# EAGLE schematic pc_healthypi_v1 (EAGLE 6.4)

## Sheet 1 of 3
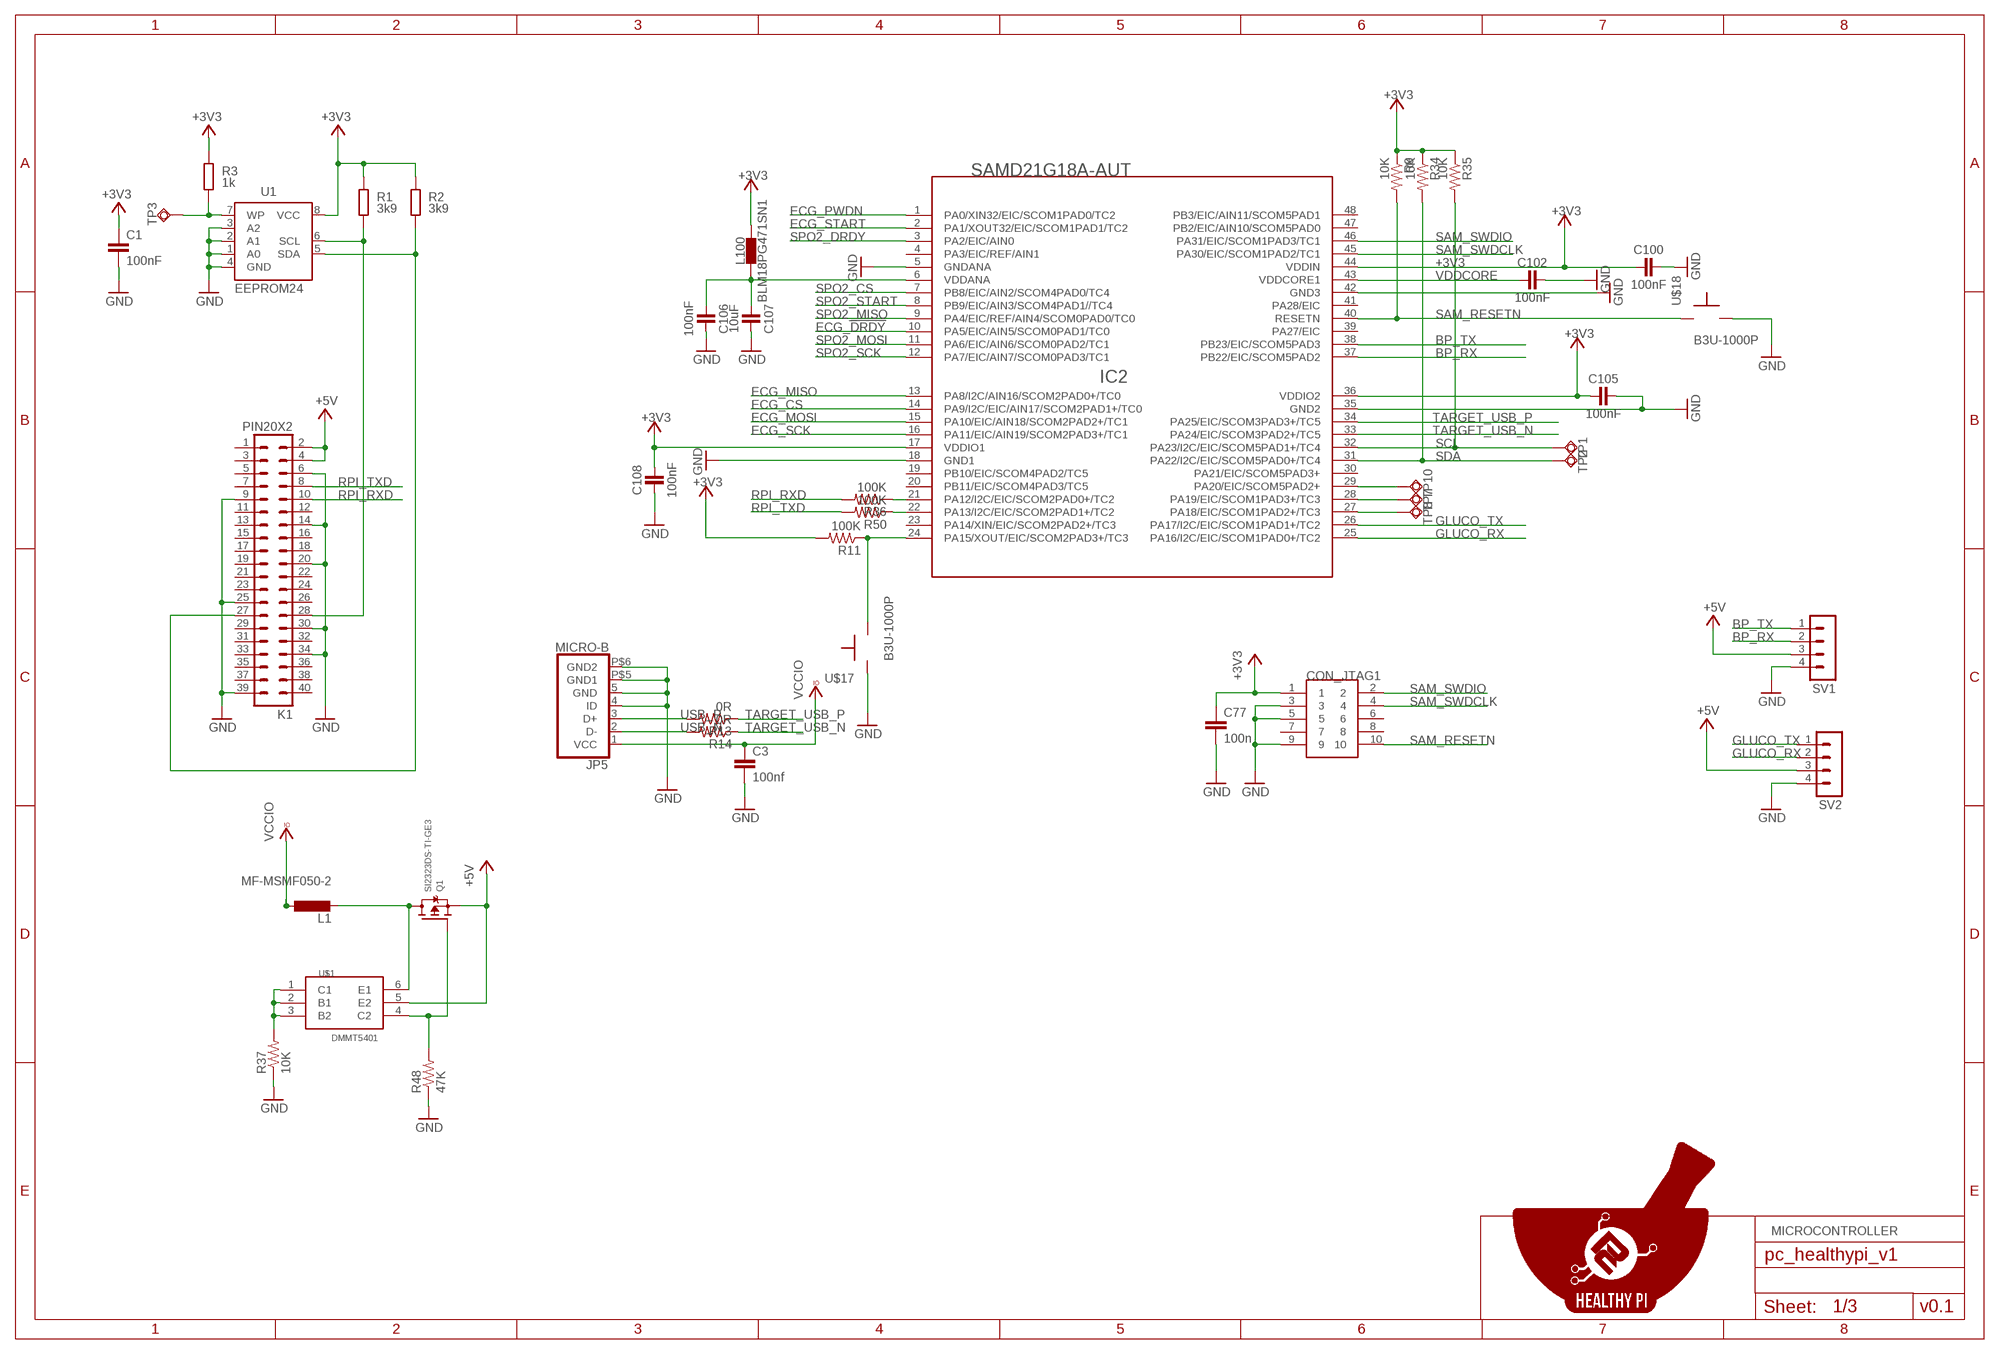
[diagram p0: schematic, sheet 1]

### Parts
C1  100nF  C-EUC0805K  [C0805K]
C3  100nf  C-EUC0402  [C0402]
C77  100n  C-EUC0805  [C0805]
C100  100nF  CAPACITORS-0805  [C0805]
C102  100nF  CAPACITORS-0805  [C0805]
C105  100nF  CAPACITORS-0805  [C0805]
C106  100nF  CAPACITORS-0805  [C0805]
C107  10uF  CAPACITORS-0805  [C0805]
C108  100nF  CAPACITORS-0805  [C0805]
CON_JTAG1  HDR-SMT-50MIL/5X2  [HDR-SMT-50MIL/5X2]
IC2  SAMD21G18A-AUT  SAMD21G18A  [TQFP48]
JP5  MICRO-B  [MICRO-B]
K1  PIN20X2  [PIN_20X2]
L1  MF-MSMF050-2  L-EUL1812  [L1812]
L100  BLM18PG471SN1  INDUCTOR-0603  [C0603]
Q1  SI2323DS-TI-GE3  MOSFET-P  [SOT23-R]
R1  3k9  R-EU_M0805  [M0805]
R2  3k9  R-EU_M0805  [M0805]
R3  1k  R-EU_M0805  [M0805]
R9  10K  R-US_R0805  [R0805]
R11  100K  R-US_R0805  [R0805]
R13  0R  R-US_R0402  [R0402]
R14  0R  R-US_R0402  [R0402]
R34  10K  R-US_R0805  [R0805]
R35  10K  R-US_R0805  [R0805]
R36  100K  R-US_R0402  [R0402]
R37  10K  R-US_R0805  [R0805]
R48  47K  R-US_R0805  [R0805]
R50  100K  R-US_R0402  [R0402]
SV1  MA04-1  [MA04-1]
SV2  MA04-1  [MA04-1]
TP1  TPSQB1,27  [B1,27]
TP2  TPSQB1,27  [B1,27]
TP3  TPSQB1,27  [B1,27]
TP7  TPSQB1,27  [B1,27]
TP8  TPSQB1,27  [B1,27]
TP10  TPSQB1,27  [B1,27]
U1  EEPROM24  [SOIC8]
U$1  DMMT5401  [SOT26]
U$15  HEALTHYPI  [HEALTHYPI]
U$17  B3U-1000P  [B3U-1000P]
U$18  B3U-1000P  [B3U-1000P]

### Nets
+3V3: C1.1 C77.1 C100.1 C105.1 C108.2 CON_JTAG1.1 IC2.17(VDDIO1) IC2.36(VDDIO2) IC2.44(VDDIN) L100.2 R1.2 R2.2 R3.2 R9.1 R11.2 R34.1 R35.1 U1.8(VCC) ; also sheet 2,3
+5V: K1.2 K1.4 Q1.2(S) SV1.3 SV2.3 U$1.5(E2) ; also sheet 2,3
BP_RX: IC2.37(PB22/EIC/SCOM5PAD2) SV1.2
BP_TX: IC2.38(PB23/EIC/SCOM5PAD3) SV1.1
ECG_!DRDY: IC2.10(PA5/EIC/AIN5/SCOM0PAD1/TC0) ; also sheet 2
ECG_CS: IC2.14(PA9/I2C/EIC/AIN17/SCOM2PAD1+/TC0) ; also sheet 2
ECG_MISO: IC2.13(PA8/I2C/AIN16/SCOM2PAD0+/TC0) ; also sheet 2
ECG_MOSI: IC2.15(PA10/EIC/AIN18/SCOM2PAD2+/TC1) ; also sheet 2
ECG_PWDN: IC2.1(PA0/XIN32/EIC/SCOM1PAD0/TC2) ; also sheet 2
ECG_SCK: IC2.16(PA11/EIC/AIN19/SCOM2PAD3+/TC1) ; also sheet 2
ECG_START: IC2.2(PA1/XOUT32/EIC/SCOM1PAD1/TC2) ; also sheet 2
GLUCO_RX: IC2.25(PA16/I2C/EIC/SCOM1PAD0+/TC2) SV2.2
GLUCO_TX: IC2.26(PA17/I2C/EIC/SCOM1PAD1+/TC2) SV2.1
GND: C1.2 C3.2 C77.2 C100.2 C102.2 C105.2 C106.2 C107.2 C108.1 CON_JTAG1.3 CON_JTAG1.5 CON_JTAG1.9 IC2.5(GNDANA) IC2.18(GND1) IC2.35(GND2) IC2.42(GND3) JP5.4(ID) JP5.5(GND) JP5.P$5(GND1) JP5.P$6(GND2) K1.6 K1.9 K1.14 K1.20 K1.25 K1.30 K1.34 K1.39 R37.1 R48.1 SV1.4 SV2.4 U1.1(A0) U1.2(A1) U1.3(A2) U1.4(GND) U$17.P$1 U$18.P$2 ; also sheet 2,3
N$1: K1.28 R1.1 U1.6(SCL)
N$2: K1.27 R2.1 U1.5(SDA)
N$3: R3.1 TP3.TP U1.7(WP)
N$6: C106.1 C107.1 IC2.6(VDDANA) L100.1
N$53: IC2.21(PA12/I2C/EIC/SCOM2PAD0+/TC2) R36.1
N$54: IC2.22(PA13/I2C/EIC/SCOM2PAD1+/TC2) R50.1
N$57: IC2.24(PA15/XOUT/EIC/SCOM2PAD3+/TC3) R11.1 U$17.P$2
N$67: IC2.27(PA18/EIC/SCOM1PAD2+/TC3) TP8.TP
N$68: IC2.28(PA19/EIC/SCOM1PAD3+/TC3) TP7.TP
N$69: IC2.29(PA20/EIC/SCOM5PAD2+) TP10.TP
N$72: R37.2 U$1.1(C1) U$1.2(B1) U$1.3(B2)
N$73: Q1.1(G) R48.2 U$1.4(C2)
N$80: L1.2 Q1.3(D) U$1.6(E1)
RPI_RXD: K1.10 R36.2
RPI_TXD: K1.8 R50.2
SAM_RESETN: CON_JTAG1.10 IC2.40(RESETN) R9.2 U$18.P$1
SAM_SWDCLK: CON_JTAG1.4 IC2.45(PA30/EIC/SCOM1PAD2/TC1)
SAM_SWDIO: CON_JTAG1.2 IC2.46(PA31/EIC/SCOM1PAD3/TC1)
SCL: IC2.32(PA23/I2C/EIC/SCOM5PAD1+/TC4) R35.2 TP1.TP
SDA: IC2.31(PA22/I2C/EIC/SCOM5PAD0+/TC4) R34.2 TP2.TP
SPO2_CS: IC2.7(PB8/EIC/AIN2/SCOM4PAD0/TC4) ; also sheet 2
SPO2_DRDY: IC2.3(PA2/EIC/AIN0) ; also sheet 2
SPO2_MISO: IC2.9(PA4/EIC/REF/AIN4/SCOM0PAD0/TC0) ; also sheet 2
SPO2_MOSI: IC2.11(PA6/EIC/AIN6/SCOM0PAD2/TC1) ; also sheet 2
SPO2_SCK: IC2.12(PA7/EIC/AIN7/SCOM0PAD3/TC1) ; also sheet 2
SPO2_START: IC2.8(PB9/EIC/AIN3/SCOM4PAD1//TC4) ; also sheet 2
TARGET_USB_N [USBpair]: IC2.33(PA24/EIC/SCOM3PAD2+/TC5) R14.1
TARGET_USB_P [USBpair]: IC2.34(PA25/EIC/SCOM3PAD3+/TC5) R13.1
USB_N [USBpair]: JP5.2(D-) R14.2
USB_P [USBpair]: JP5.3(D+) R13.2
VCCIO: C3.1 JP5.1(VCC) L1.1
VDDCORE: C102.1 IC2.43(VDDCORE1)
Unconnected: CON_JTAG1.6 CON_JTAG1.7 CON_JTAG1.8 IC2.4(PA3/EIC/REF/AIN1) IC2.19(PB10/EIC/SCOM4PAD2/TC5) IC2.20(PB11/EIC/SCOM4PAD3/TC5) IC2.23(PA14/XIN/EIC/SCOM2PAD2+/TC3) IC2.30(PA21/EIC/SCOM5PAD3+) IC2.39(PA27/EIC) IC2.41(PA28/EIC) IC2.47(PB2/EIC/AIN10/SCOM5PAD0) IC2.48(PB3/EIC/AIN11/SCOM5PAD1) K1.1 K1.3 K1.5 K1.7 K1.11 K1.12 K1.13 K1.15 K1.16 K1.17 K1.18 K1.19 K1.21 K1.22 K1.23 K1.24 K1.26 K1.29 K1.31 K1.32 K1.33 K1.35 K1.36 K1.37 K1.38 K1.40

### Notes on the sheet
- MICROCONTROLLER
- v0.1

## Sheet 2 of 3
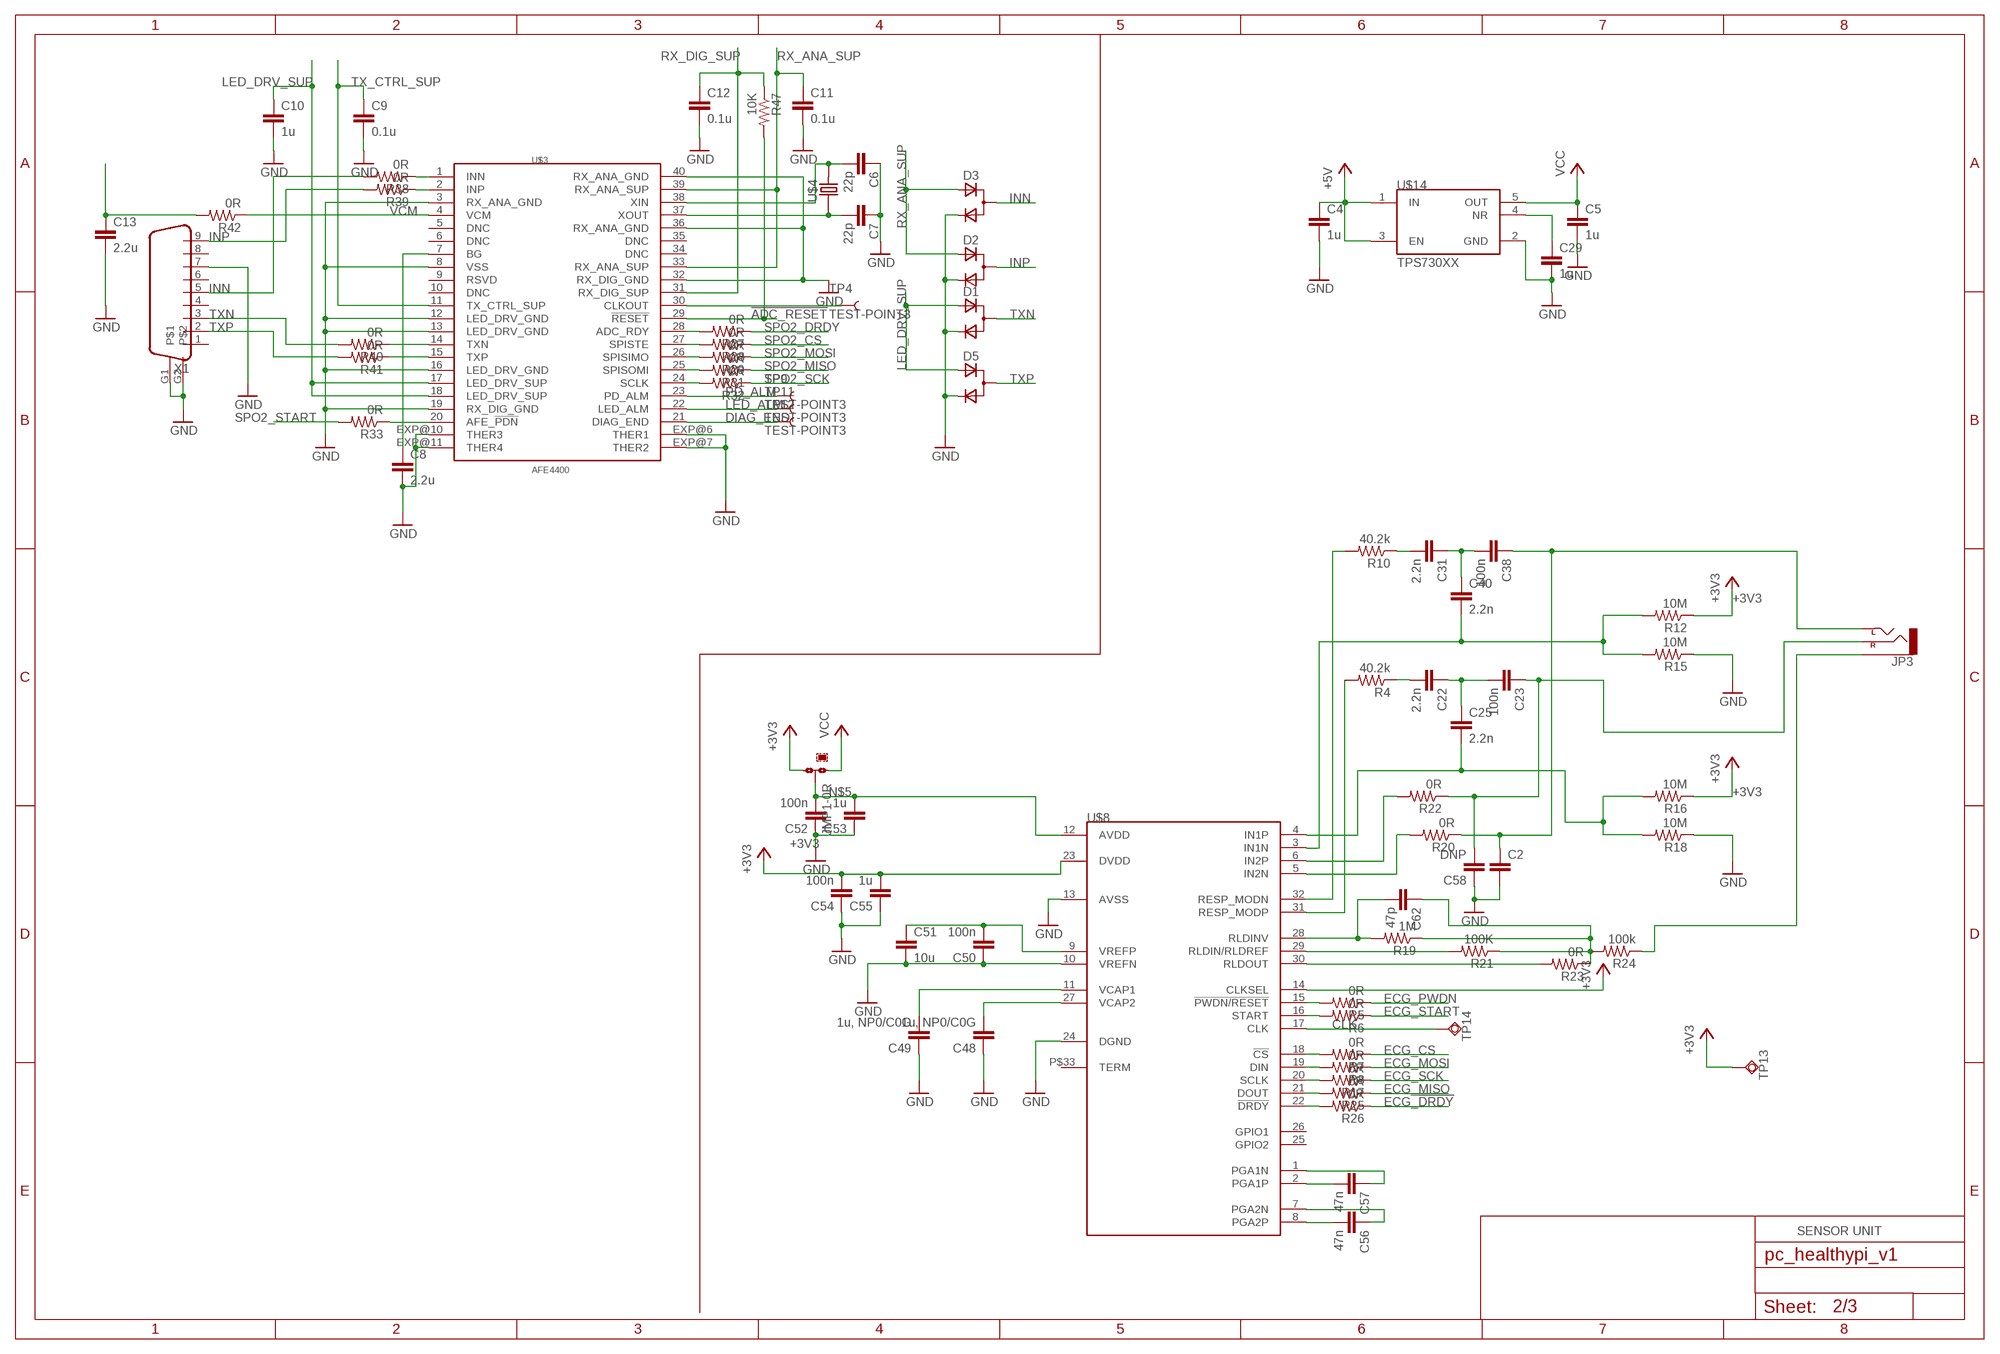
[diagram p1: schematic, sheet 2]

### Parts
C2  C-EUC0402  [C0402]
C4  1u  C-EUC0402  [C0402]
C5  1u  C-EUC0402  [C0402]
C6  22p  C-EUC0402  [C0402]
C7  22p  C-EUC0402  [C0402]
C8  2.2u  C-EUC0402  [C0402]
C9  0.1u  C-EUC0402  [C0402]
C10  1u  C-EUC0805  [C0805]
C11  0.1u  C-EUC0402  [C0402]
C12  0.1u  C-EUC0402  [C0402]
C13  2.2u  C-EUC0402  [C0402]
C22  2.2n  C-EUC0402  [C0402]
C23  100n  C-EUC0402  [C0402]
C25  2.2n  C-EUC0402  [C0402]
C29  1u  C-EUC0402  [C0402]
C31  2.2n  C-EUC0402  [C0402]
C38  100n  C-EUC0402  [C0402]
C40  2.2n  C-EUC0402  [C0402]
C48  1u, NP0/C0G  C-EUC0402  [C0402]
C49  1u, NP0/C0G  C-EUC0402  [C0402]
C50  100n  C-EUC0402  [C0402]
C51  10u  C-EUC0603  [C0603]
C52  100n  C-EUC0402  [C0402]
C53  1u  C-EUC0402  [C0402]
C54  100n  C-EUC0402  [C0402]
C55  1u  C-EUC0402  [C0402]
C56  47n  C-EUC0402  [C0402]
C57  47n  C-EUC0402  [C0402]
C58  DNP  C-EUC0402  [C0402]
C62  47p  C-EUC0402  [C0402]
D1  D_ACACSOT323  [SOT323]
D2  D_ACACSOT323  [SOT323]
D3  D_ACACSOT323  [SOT323]
D5  D_ACACSOT323  [SOT323]
JMP1  0R-JUMPB  [B0R-JMP]
JP3  AUDIO-JACKSMD2  [AUDIO-JACK-3.5MM-SMD]
R4  40.2k  R-US_R0402  [R0402]
R5  0R  R-US_R0402  [R0402]
R6  0R  R-US_R0402  [R0402]
R7  0R  R-US_R0402  [R0402]
R8  0R  R-US_R0402  [R0402]
R10  40.2k  R-US_R0402  [R0402]
R12  10M  R-US_R0402  [R0402]
R15  10M  R-US_R0402  [R0402]
R16  10M  R-US_R0402  [R0402]
R17  0R  R-US_R0402  [R0402]
R18  10M  R-US_R0402  [R0402]
R19  1M  R-US_R0402  [R0402]
R20  0R  R-US_R0402  [R0402]
R21  100K  R-US_R0402  [R0402]
R22  0R  R-US_R0402  [R0402]
R23  0R  R-US_R0402  [R0402]
R24  100k  R-US_R0402  [R0402]
R25  0R  R-US_R0402  [R0402]
R26  0R  R-US_R0402  [R0402]
R27  0R  R-US_R0402  [R0402]
R28  0R  R-US_R0402  [R0402]
R29  0R  R-US_R0402  [R0402]
R31  0R  R-US_R0402  [R0402]
R32  0R  R-US_R0402  [R0402]
R33  0R  R-US_R0402  [R0402]
R38  0R  R-US_R0402  [R0402]
R39  0R  R-US_R0402  [R0402]
R40  0R  R-US_R0402  [R0402]
R41  0R  R-US_R0402  [R0402]
R42  0R  R-US_R0402  [R0402]
R47  10K  R-US_R0402  [R0402]
TP4  TEST-POINT3  [PAD.03X.03]
TP9  TEST-POINT3  [PAD.03X.03]
TP11  TEST-POINT3  [PAD.03X.03]
TP12  TEST-POINT3  [PAD.03X.03]
TP13  TPSQB1,27  [B1,27]
TP14  TPSQB1,27  [B1,27]
U$3  AFE4400  [QFN-40]
U$4  ABM3  [ABM3]
U$8  ADS1292RPVQFN32  [S-PVQFN-N32]
U$14  TPS730XX  [SOT23-DBV]
X1  DB9  [DB9]

### Nets
!ADC_RESET: R47.2 U$3.29(!RESET)
+3V3: C54.2 C55.2 JMP1.3 R12.1 R16.1 TP13.TP U$8.14(CLKSEL) U$8.23(DVDD) ; also sheet 1,3
+5V: C4.1 U$14.1(IN) U$14.3(EN) ; also sheet 1,3
CLK: TP14.TP U$8.17(CLK)
DIAG_END: TP12.P$1 U$3.21(DIAG_END)
ECG_!DRDY: R26.1 ; also sheet 1
ECG_CS: R7.1 ; also sheet 1
ECG_MISO: R25.1 ; also sheet 1
ECG_MOSI: R8.1 ; also sheet 1
ECG_PWDN: R5.1 ; also sheet 1
ECG_SCK: R17.1 ; also sheet 1
ECG_START: R6.1 ; also sheet 1
GND: C2.2 C4.2 C5.2 C6.1 C7.1 C8.2 C9.2 C10.2 C11.2 C12.2 C13.2 C29.2 C48.1 C49.1 C50.1 C51.2 C52.1 C53.1 C54.1 C55.1 C58.1 D1.2(C) D2.2(C) D3.2(C) D5.2(C) R15.1 R18.1 U$3.3(RX_ANA_GND) U$3.8(VSS) U$3.12(LED_DRV_GND) U$3.13(LED_DRV_GND) U$3.16(LED_DRV_GND) U$3.19(RX_DIG_GND) U$3.32(RX_DIG_GND) U$3.36(RX_ANA_GND) U$3.40(RX_ANA_GND) U$3.EXP@6(THER1) U$3.EXP@7(THER2) U$3.EXP@10(THER3) U$3.EXP@11(THER4) U$8.10(VREFN) U$8.13(AVSS) U$8.24(DGND) U$14.2(GND) X1.7 X1.G1 X1.G2 ; also sheet 1,3
INN: D3.1(CA) R38.2 X1.5
INP: D2.1(CA) R39.2 X1.9
LED_ALM: TP11.P$1 U$3.22(LED_ALM)
LED_DRV_SUP: C10.1 D1.3(A) D5.3(A) U$3.17(LED_DRV_SUP) U$3.18(LED_DRV_SUP) ; also sheet 3
N$5: C52.2 C53.2 JMP1.2 U$8.12(AVDD)
N$8: R4.2 U$8.31(RESP_MODP)
N$9: C6.2 U$3.38(XIN) U$4.2
N$10: C22.2 R4.1
N$11: C22.1 C23.2 C25.1
N$12: R22.2 U$8.6(IN2P)
N$13: C7.2 U$3.37(XOUT) U$4.1
N$14: R20.2 U$8.5(IN2N)
N$15: C8.1 U$3.7(BG)
N$16: TP4.P$1 U$3.30(CLKOUT)
N$17: R38.1 U$3.1(INN)
N$18: R39.1 U$3.2(INP)
N$19: C48.2 U$8.27(VCAP2)
N$20: R40.1 U$3.14(TXN)
N$21: R41.1 U$3.15(TXP)
N$23: C13.1 R42.2
N$26: R10.2 U$8.32(RESP_MODN)
N$28: C31.2 R10.1
N$29: C31.1 C38.2 C40.1
N$30: C2.1 C38.1 JP3.TIP(LEFT) R20.1
N$31: C40.2 R12.2 R15.2 U$8.3(IN1N)
N$32: C25.2 R16.2 R18.2 U$8.4(IN1P)
N$33: R21.2 U$8.29(RLDIN/RLDREF)
N$34: C62.2 R19.2 U$8.28(RLDINV)
N$35: C62.1 R19.1 R21.1 R23.1 R24.2
N$36: C49.2 U$8.11(VCAP1)
N$37: C56.2 U$8.8(PGA2P)
N$38: C56.1 U$8.7(PGA2N)
N$40: C50.2 C51.1 U$8.9(VREFP)
N$41: C57.2 U$8.2(PGA1P)
N$43: C57.1 U$8.1(PGA1N)
N$45: C23.1 C58.2 JP3.RING(RIGHT) R22.1
N$50: R23.2 U$8.30(RLDOUT)
N$51: JP3.SLEEVE R24.1
N$52: R5.2 U$8.15(!PWDN/RESET)
N$55: R6.2 U$8.16(START)
N$56: R7.2 U$8.18(!CS)
N$58: R8.2 U$8.19(DIN)
N$59: R17.2 U$8.20(SCLK)
N$60: R25.2 U$8.21(DOUT)
N$61: R26.2 U$8.22(!DRDY)
N$62: R33.1 U$3.20(AFE_!PDN)
N$63: R27.2 U$3.28(ADC_RDY)
N$64: R28.2 U$3.27(SPISTE)
N$65: R29.2 U$3.26(SPISIMO)
N$66: R31.2 U$3.25(SPISOMI)
N$70: R32.2 U$3.24(SCLK)
N$71: C29.1 U$14.4(NR)
PD_ALM: TP9.P$1 U$3.23(PD_ALM)
RX_ANA_SUP: C11.1 D2.3(A) D3.3(A) U$3.33(RX_ANA_SUP) U$3.39(RX_ANA_SUP) ; also sheet 3
RX_DIG_SUP: C12.1 R47.1 U$3.31(RX_DIG_SUP) ; also sheet 3
SPO2_CS: R28.1 ; also sheet 1
SPO2_DRDY: R27.1 ; also sheet 1
SPO2_MISO: R31.1 ; also sheet 1
SPO2_MOSI: R29.1 ; also sheet 1
SPO2_SCK: R32.1 ; also sheet 1
SPO2_START: R33.2 ; also sheet 1
TX_CTRL_SUP: C9.1 U$3.11(TX_CTRL_SUP) ; also sheet 3
TXN: D1.1(CA) R40.2 X1.3
TXP: D5.1(CA) R41.2 X1.2
VCC: C5.1 JMP1.1 U$14.5(OUT)
VCM: R42.1 U$3.4(VCM)
Unconnected: U$3.5(DNC) U$3.6(DNC) U$3.9(RSVD) U$3.10(DNC) U$3.34(DNC) U$3.35(DNC) U$8.25(GPIO2) U$8.26(GPIO1) U$8.P$33(TERM) X1.1 X1.4 X1.6 X1.8

### Notes on the sheet
- SENSOR UNIT

## Sheet 3 of 3
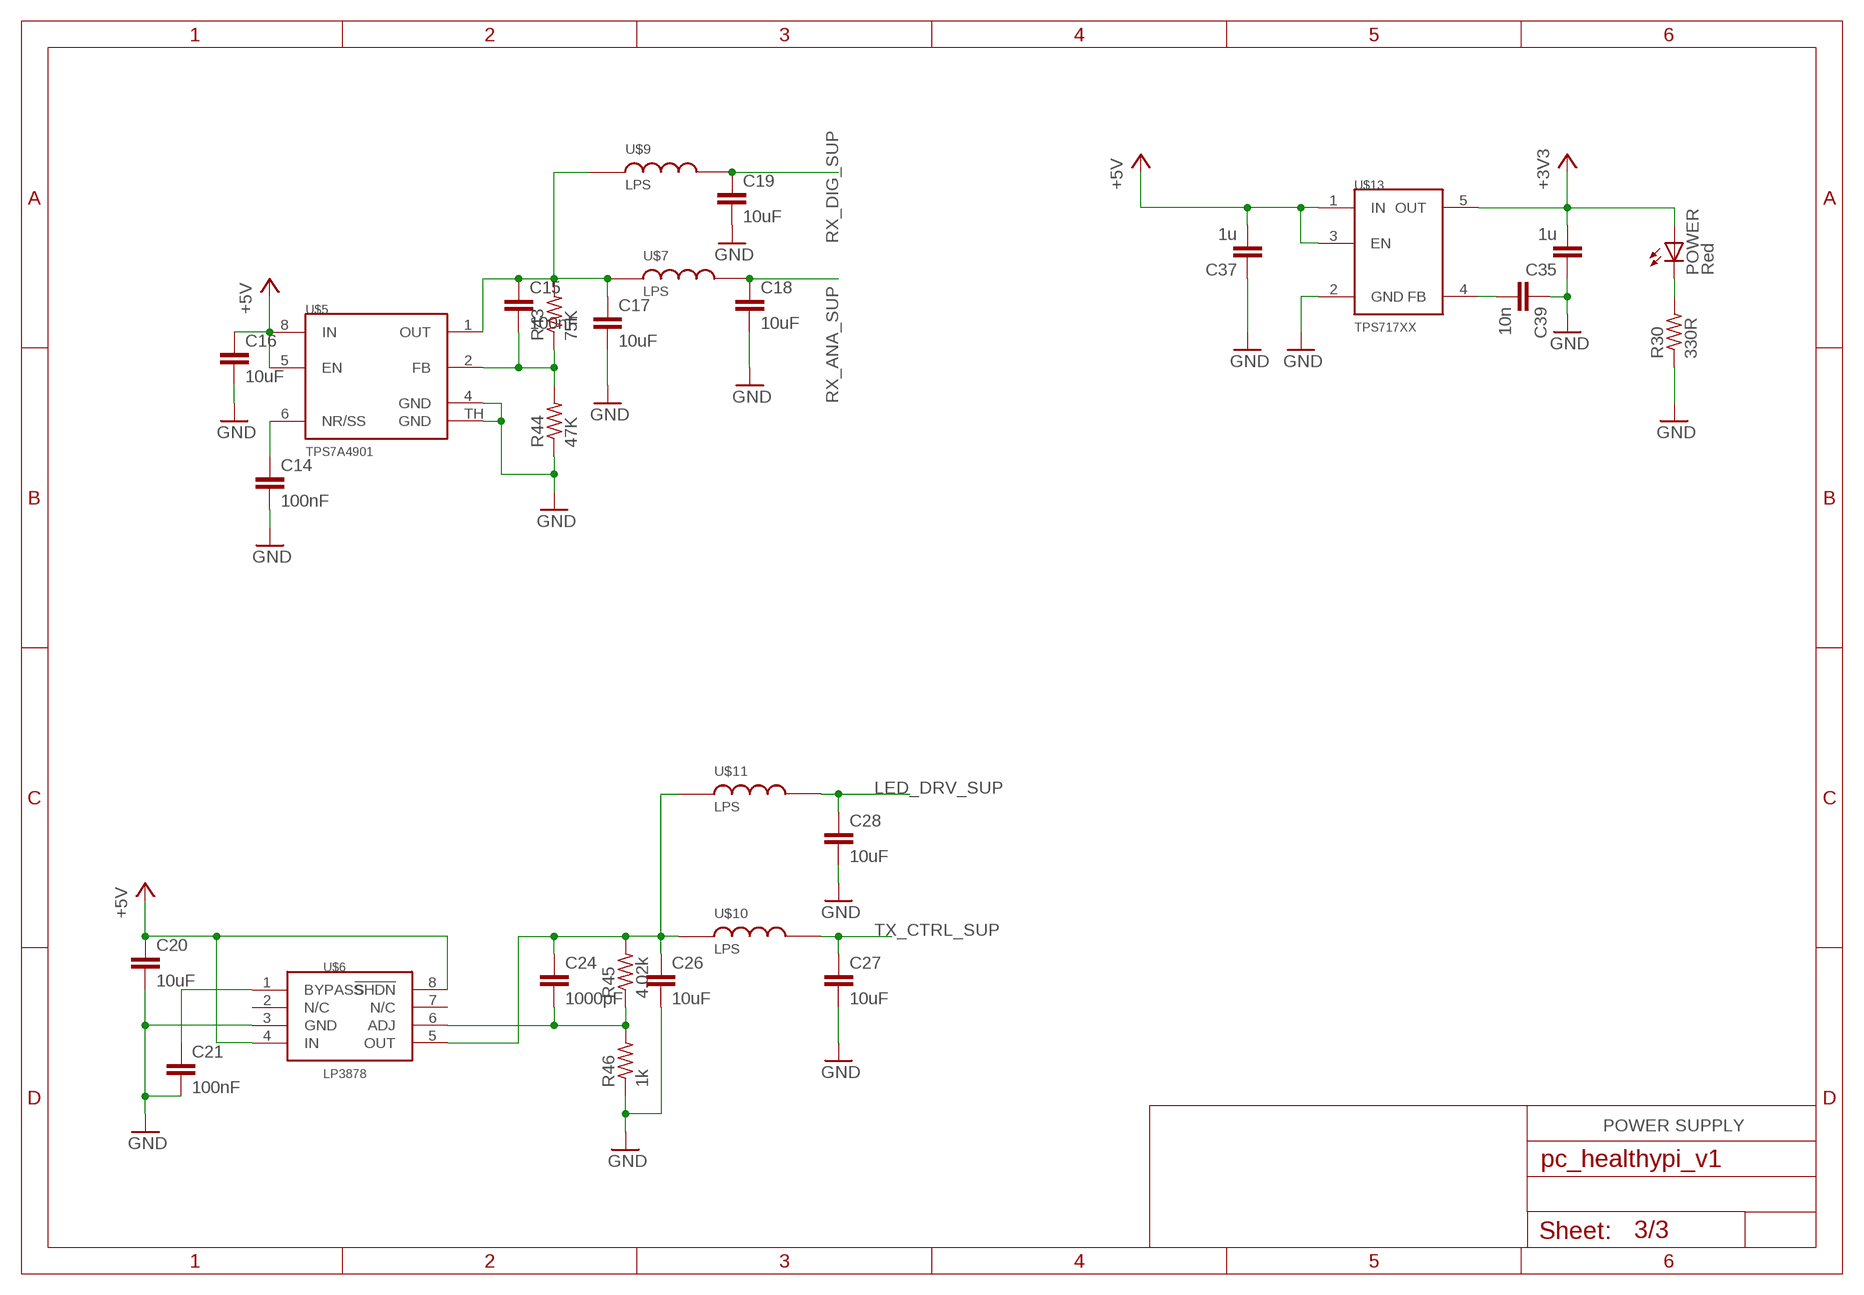
[diagram p2: schematic, sheet 3]

### Parts
C14  100nF  C-EUC0402  [C0402]
C15  100nF  C-EUC0402  [C0402]
C16  10uF  C-EUC0805  [C0805]
C17  10uF  C-EUC0805  [C0805]
C18  10uF  C-EUC0805  [C0805]
C19  10uF  C-EUC0805  [C0805]
C20  10uF  C-EUC0805  [C0805]
C21  100nF  C-EUC0402  [C0402]
C24  1000pF  C-EUC0402  [C0402]
C26  10uF  C-EUC0805  [C0805]
C27  10uF  C-EUC0805  [C0805]
C28  10uF  C-EUC0805  [C0805]
C35  1u  C-EUC0402  [C0402]
C37  1u  C-EUC0402  [C0402]
C39  10n  C-EUC0402  [C0402]
POWER  Red  LEDCHIPLED_0603  [CHIPLED_0603]
R30  330R  R-US_R0402  [R0402]
R43  75K  R-US_R0402  [R0402]
R44  47K  R-US_R0402  [R0402]
R45  4.02k  R-US_R0402  [R0402]
R46  1k  R-US_R0402  [R0402]
U$5  TPS7A4901  [S-PDSO-G08]
U$6  LP3878  [DDA]
U$7  LPS  [LPS]
U$9  LPS  [LPS]
U$10  LPS  [LPS]
U$11  LPS  [LPS]
U$13  TPS717XX  [SC70-5]

### Nets
+3V3: C35.2 POWER.A U$13.5(OUT) ; also sheet 1,2
+5V: C16.1 C20.1 C37.2 U$5.5(EN) U$5.8(IN) U$6.4(IN) U$6.8(!SHDN) U$13.1(IN) U$13.3(EN) ; also sheet 1,2
GND: C14.2 C16.2 C17.2 C18.2 C19.2 C20.2 C21.2 C26.2 C27.2 C28.2 C35.1 C37.1 C39.1 R30.1 R44.1 R46.1 U$5.4(GND) U$5.TH(GND) U$6.3(GND) U$13.2(GND) ; also sheet 1,2
LED_DRV_SUP: C28.1 U$11.2 ; also sheet 2
N$4: C39.2 U$13.4(FB)
N$7: POWER.C R30.2
N$25: C14.1 U$5.6(NR/SS)
N$27: C15.1 C17.1 R43.2 U$5.1(OUT) U$7.1 U$9.1
N$39: C15.2 R43.1 R44.2 U$5.2(FB)
N$42: C21.1 U$6.1(BYPASS)
N$44: C24.1 C26.1 R45.2 U$6.5(OUT) U$10.1 U$11.1
N$46: C24.2 R45.1 R46.2 U$6.6(ADJ)
RX_ANA_SUP: C18.1 U$7.2 ; also sheet 2
RX_DIG_SUP: C19.1 U$9.2 ; also sheet 2
TX_CTRL_SUP: C27.1 U$10.2 ; also sheet 2
Unconnected: U$6.2(N/C) U$6.7(N/C)

### Notes on the sheet
- POWER SUPPLY

## Library data of the parts
C1 = resistor:C-EU: CAPACITOR, European symbol; DIELECTRIC: X7R
C2-C29 C31 C35 C37-C40 C48-C50 C52-C58 C62 C77 = rcl:C-EU: CAPACITOR, European symbol
C51 = resistor:C-EU: CAPACITOR, European symbol
C100 C102 C105-C108 = Arduino:CAPACITORS: Capacitors ...4.7uF @ 6.3V -> 0402 ...10uF @ 16V -> 0603 ...22uF @ 25V -> 0805
CON_JTAG1 = circuitects:HDR-SMT-50MIL/5X2
D1-D3 D5 = zetex:D_ACAC: Dual DIODE; OC_FARNELL: unknown; OC_NEWARK: unknown
IC2 = Arduino:SAMD21G18A: Atmel D21 32bit ARM Cortex-M0 microcontroller - 48 PIN TQFP 256KB flash memory + 32KB SRAM
JMP1 = jump-0r-smd:0R-JUMP: SMD 0R 0805 Jumper
JP3 = SparkFun-Connectors:AUDIO-JACK: 3.5mm Audio Jack Simple 3.5mm common PCB mount audio jack. SKU: PRT-08032; PROD_ID: CONN-10353
JP5 = circuitects:MICRO-B
K1 = FLYFISH:PIN20X2
L1 = rcl:L-EU: INDUCTOR, European symbol
L100 = Arduino:INDUCTOR: Inductors
POWER = led:LED: LED OSRAM: - CHIPLED LG R971, LG N971, LY N971, LG Q971, LY Q971, LO R971, LY R971 LH N974, LH R974 LS Q976, LO Q976, LY Q976 LO Q996 - Hyper CHIPLED LW Q18S LB Q993, LB Q99A, LB R99A - SideLED LS A670, LO A670, LY A670, LG A670, LP A670 LB A673, LV A673, LT A673, LW A673 LH A674 LY A675 LS A676, LA A676, LO A676, LY A676, LW A676 LS A679, LY A679, LG A679 - Hyper Micro SIDELED® LS Y876, LA Y876, LO Y876, LY Y876 LT Y87S - SmartLED LW L88C, LW L88S LB L89C, LB L89S, LG L890 LS L89K, LO L89K, LY L89K LS L896, LA L896, LO L896, LY L896 - TOPLED LS T670, LO T670, LY T670, LG T670, LP T670 LSG T670, LSP T670, LSY T670, LOP T670, LYG T670 LG T671, LOG T671, LSG T671 LB T673, LV T673, LT T673, LW T673 LH T674 LS T676, LA T676, LO T676, LY T676, LB T676, LH T676, LSB T676, LW T676 LB T67C, LV T67C, LT T67C, LS T67K, LO T67K, LY T67K, LW E67C LS E67B, LA E67B, LO E67B, LY E67B, LB E67C, LV E67C, LT E67C LW T67C LS T679, LY T679, LG T679 LS T770, LO T770, LY T770, LG T770, LP T770 LB T773, LV T773, LT T773, LW T773 LH T774 LS E675, LA E675, LY E675, LS T675 LS T776, LA T776, LO T776, LY T776, LB T776 LHGB T686 LT T68C, LB T68C - Hyper Mini TOPLED® LB M676 - Mini TOPLED Santana® LG M470 LS M47K, LO M47K, LY M47K Source: http://www.osram.convergy.de LUXEON: - LUMILED® LXK2-PW12-R00, LXK2-PW12-S00, LXK2-PW14-U00, LXK2-PW14-V00 LXK2-PM12-R00, LXK2-PM12-S00, LXK2-PM14-U00 LXK2-PE12-Q00, LXK2-PE12-R00, LXK2-PE12-S00, LXK2-PE14-T00, LXK2-PE14-U00 LXK2-PB12-K00, LXK2-PB12-L00, LXK2-PB12-M00, LXK2-PB14-N00, LXK2-PB14-P00, LXK2-PB14-Q00 LXK2-PR12-L00, LXK2-PR12-M00, LXK2-PR14-Q00, LXK2-PR14-R00 LXK2-PD12-Q00, LXK2-PD12-R00, LXK2-PD12-S00 LXK2-PH12-R00, LXK2-PH12-S00 LXK2-PL12-P00, LXK2-PL12-Q00, LXK2-PL12-R00 Source: www.luxeon.com KINGBRIGHT: KA-3528ASYC Source: www.kingbright.com
Q1 = microbuilder:MOSFET-P: P-Channel Mosfet SOT-23 IRLML5103 30V 760mA 1V Vgs - Digikey: IRLML5103PBFCT-ND NTR0202PL 20V 400mA 2.3V Vgs - Digikey: NTR0202PLT1GOSTR-ND NTR4101PT1G 20V 1.8A 1.2V Vgs - Digikey: NTR4101PT1GOSCT-ND DMP2004K 20V 600mA 1V Vgs - Digikey: DMP2004KDICT-ND
R1-R3 = resistor:R-EU_: RESISTOR, European symbol; TOLERANCE: 5%
R4-R48 R50 = rcl:R-US_: RESISTOR, American symbol
SV1 SV2 = con-lstb:MA04-1: PIN HEADER; OC_FARNELL: unknown; OC_NEWARK: unknown
TP1-TP3 TP7 TP8 TP10 TP13 TP14 = testpad:TPSQ: Test pad
TP4 TP9 TP11 TP12 = SparkFun:TEST-POINT
U1 = FLYFISH:EEPROM24
U$1 = circuitects:DMMT5401
U$3 = circuitects:AFE4400
U$4 = circuitects:ABM3
U$5 = circuitects:TPS7A4901
U$6 = circuitects:LP3878
U$7 U$9-U$11 = circuitects:LPS
U$8 = circuitects:ADS1292R
U$13 = circuitects:TPS717XX
U$14 = circuitects:TPS730XX
U$15 = circuitects:HEALTHYPI
U$17 U$18 = circuitects:B3U-1000P
X1 = circuitects:DB9: DB9 Connector Standard DB9 (D-Sub 9) serial connector. Can be used for CAN bus as well as RS485 and RS232. Footprint production proven. Spark Fun Electronics SKU : PRT-00429

## Net classes
2 gnd: width 0.102 mm, drill 0.1 mm
4 USBpair: width 0.102 mm, drill 0.1 mm, clearance 0.15 mm to class 3